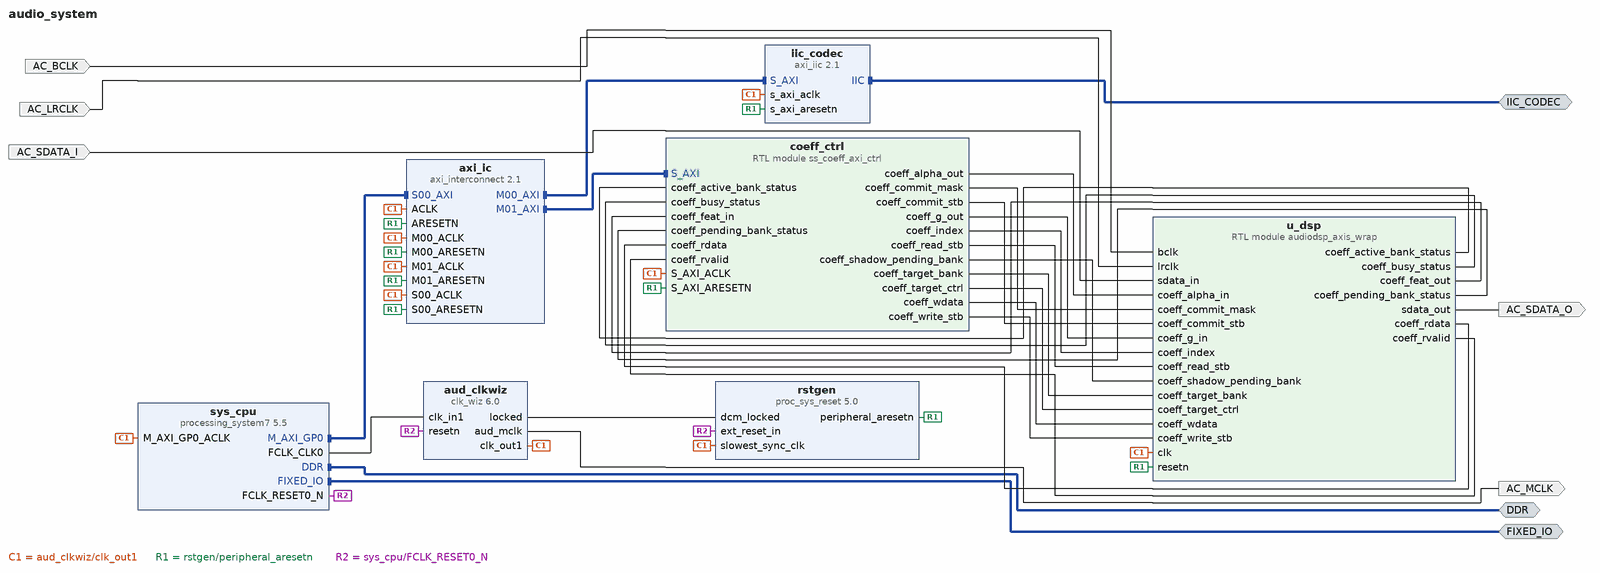
[diagram p0: block diagram of the top level]
# Vivado block design audio_system, xc7z020clg484-1, Vivado 2024.1
create_bd_design audio_system

create_bd_intf_port -mode Master -vlnv xilinx.com:interface:ddrx_rtl:1.0 DDR
create_bd_intf_port -mode Master -vlnv xilinx.com:display_processing_system7:fixedio_rtl:1.0 FIXED_IO
create_bd_intf_port -mode Master -vlnv xilinx.com:interface:iic_rtl:1.0 IIC_CODEC
create_bd_port -dir I AC_BCLK
create_bd_port -dir I AC_LRCLK
create_bd_port -dir I AC_SDATA_I
create_bd_port -dir O AC_SDATA_O
create_bd_port -dir O AC_MCLK

create_bd_cell -type ip -vlnv xilinx.com:ip:processing_system7:5.5 sys_cpu
set_property -dict [list \
  CONFIG.PCW_APU_PERIPHERAL_FREQMHZ 666.666667 \
  CONFIG.PCW_ENET0_ENET0_IO {MIO 16 .. 27} \
  CONFIG.PCW_ENET0_GRP_MDIO_ENABLE 1 \
  CONFIG.PCW_ENET0_GRP_MDIO_IO {MIO 52 .. 53} \
  CONFIG.PCW_ENET0_PERIPHERAL_ENABLE 1 \
  CONFIG.PCW_ENET0_RESET_ENABLE 0 \
  CONFIG.PCW_ENET_RESET_ENABLE 1 \
  CONFIG.PCW_ENET_RESET_SELECT {Share reset pin} \
  CONFIG.PCW_FPGA0_PERIPHERAL_FREQMHZ 100.0 \
  CONFIG.PCW_FPGA1_PERIPHERAL_FREQMHZ 150.000000 \
  CONFIG.PCW_GPIO_MIO_GPIO_ENABLE 1 \
  CONFIG.PCW_GPIO_MIO_GPIO_IO MIO \
  CONFIG.PCW_I2C_RESET_ENABLE 1 \
  CONFIG.PCW_PRESET_BANK1_VOLTAGE {LVCMOS 1.8V} \
  CONFIG.PCW_QSPI_GRP_SINGLE_SS_ENABLE 1 \
  CONFIG.PCW_QSPI_GRP_SINGLE_SS_IO {MIO 1 .. 6} \
  CONFIG.PCW_QSPI_PERIPHERAL_ENABLE 1 \
  CONFIG.PCW_QSPI_QSPI_IO {MIO 1 .. 6} \
  CONFIG.PCW_SD0_GRP_CD_ENABLE 1 \
  CONFIG.PCW_SD0_GRP_CD_IO {MIO 47} \
  CONFIG.PCW_SD0_GRP_WP_ENABLE 1 \
  CONFIG.PCW_SD0_GRP_WP_IO {MIO 46} \
  CONFIG.PCW_SD0_PERIPHERAL_ENABLE 1 \
  CONFIG.PCW_SD0_SD0_IO {MIO 40 .. 45} \
  CONFIG.PCW_SDIO_PERIPHERAL_FREQMHZ 50 \
  CONFIG.PCW_SINGLE_QSPI_DATA_MODE x4 \
  CONFIG.PCW_TTC0_PERIPHERAL_ENABLE 1 \
  CONFIG.PCW_TTC0_TTC0_IO EMIO \
  CONFIG.PCW_UART1_PERIPHERAL_ENABLE 1 \
  CONFIG.PCW_UART1_UART1_IO {MIO 48 .. 49} \
  CONFIG.PCW_UART_PERIPHERAL_FREQMHZ 50 \
  CONFIG.PCW_UIPARAM_DDR_FREQ_MHZ 533.333313 \
  CONFIG.PCW_UIPARAM_DDR_PARTNO {MT41J128M16 HA-15E} \
  CONFIG.PCW_USB0_PERIPHERAL_ENABLE 1 \
  CONFIG.PCW_USB0_RESET_ENABLE 0 \
  CONFIG.PCW_USB0_USB0_IO {MIO 28 .. 39} \
  CONFIG.PCW_USB_RESET_ENABLE 1 \
  CONFIG.PCW_USB_RESET_SELECT {Share reset pin} \
  CONFIG.preset ZedBoard \
] [get_bd_cells sys_cpu]
# 227 more settings of sys_cpu are not shown: defaults, MIO pin electricals, DDR timing, and values the tool derives
create_bd_cell -type ip -vlnv xilinx.com:ip:clk_wiz:6.0 aud_clkwiz
set_property -dict [list \
  CONFIG.CLKOUT1_JITTER 146.380 \
  CONFIG.CLKOUT1_REQUESTED_OUT_FREQ 100 \
  CONFIG.CLKOUT2_REQUESTED_OUT_FREQ 12.288 \
  CONFIG.CLKOUT2_USED true \
  CONFIG.CLK_OUT2_PORT aud_mclk \
  CONFIG.MMCM_CLKOUT0_DIVIDE_F 7.250 \
  CONFIG.PRIM_SOURCE Global_buffer \
  CONFIG.RESET_TYPE ACTIVE_LOW \
] [get_bd_cells aud_clkwiz]
create_bd_cell -type ip -vlnv xilinx.com:ip:proc_sys_reset:5.0 rstgen
create_bd_cell -type ip -vlnv xilinx.com:ip:axi_interconnect:2.1 axi_ic
set_property -dict {CONFIG.NUM_MI 2 CONFIG.NUM_SI 1} [get_bd_cells axi_ic]
create_bd_cell -type ip -vlnv xilinx.com:ip:axi_iic:2.1 iic_codec
create_bd_cell -type module -reference audiodsp_axis_wrap u_dsp
create_bd_cell -type module -reference ss_coeff_axi_ctrl coeff_ctrl

# ---- connections ----

connect_bd_intf_net [get_bd_intf_pins axi_ic/M00_AXI] [get_bd_intf_pins iic_codec/S_AXI]
connect_bd_intf_net [get_bd_intf_pins axi_ic/M01_AXI] [get_bd_intf_pins coeff_ctrl/S_AXI]
connect_bd_intf_net [get_bd_intf_pins iic_codec/IIC] [get_bd_intf_ports IIC_CODEC]
connect_bd_intf_net [get_bd_intf_ports DDR] [get_bd_intf_pins sys_cpu/DDR]
connect_bd_intf_net [get_bd_intf_ports FIXED_IO] [get_bd_intf_pins sys_cpu/FIXED_IO]
connect_bd_intf_net [get_bd_intf_pins sys_cpu/M_AXI_GP0] [get_bd_intf_pins axi_ic/S00_AXI]
connect_bd_net [get_bd_ports AC_BCLK] [get_bd_pins u_dsp/bclk]
connect_bd_net [get_bd_ports AC_LRCLK] [get_bd_pins u_dsp/lrclk]
connect_bd_net [get_bd_ports AC_SDATA_I] [get_bd_pins u_dsp/sdata_in]
connect_bd_net [get_bd_pins aud_clkwiz/aud_mclk] [get_bd_ports AC_MCLK]
connect_bd_net [get_bd_pins aud_clkwiz/clk_out1] \
  [get_bd_pins rstgen/slowest_sync_clk] [get_bd_pins axi_ic/ACLK] [get_bd_pins axi_ic/S00_ACLK] [get_bd_pins axi_ic/M00_ACLK] \
  [get_bd_pins axi_ic/M01_ACLK] [get_bd_pins sys_cpu/M_AXI_GP0_ACLK] [get_bd_pins iic_codec/s_axi_aclk] \
  [get_bd_pins u_dsp/clk] [get_bd_pins coeff_ctrl/S_AXI_ACLK]
connect_bd_net [get_bd_pins aud_clkwiz/locked] [get_bd_pins rstgen/dcm_locked]
connect_bd_net [get_bd_pins coeff_ctrl/coeff_alpha_out] [get_bd_pins u_dsp/coeff_alpha_in]
connect_bd_net [get_bd_pins coeff_ctrl/coeff_commit_mask] [get_bd_pins u_dsp/coeff_commit_mask]
connect_bd_net [get_bd_pins coeff_ctrl/coeff_commit_stb] [get_bd_pins u_dsp/coeff_commit_stb]
connect_bd_net [get_bd_pins coeff_ctrl/coeff_g_out] [get_bd_pins u_dsp/coeff_g_in]
connect_bd_net [get_bd_pins coeff_ctrl/coeff_index] [get_bd_pins u_dsp/coeff_index]
connect_bd_net [get_bd_pins coeff_ctrl/coeff_read_stb] [get_bd_pins u_dsp/coeff_read_stb]
connect_bd_net [get_bd_pins coeff_ctrl/coeff_shadow_pending_bank] [get_bd_pins u_dsp/coeff_shadow_pending_bank]
connect_bd_net [get_bd_pins coeff_ctrl/coeff_target_bank] [get_bd_pins u_dsp/coeff_target_bank]
connect_bd_net [get_bd_pins coeff_ctrl/coeff_target_ctrl] [get_bd_pins u_dsp/coeff_target_ctrl]
connect_bd_net [get_bd_pins coeff_ctrl/coeff_wdata] [get_bd_pins u_dsp/coeff_wdata]
connect_bd_net [get_bd_pins coeff_ctrl/coeff_write_stb] [get_bd_pins u_dsp/coeff_write_stb]
connect_bd_net [get_bd_pins rstgen/peripheral_aresetn] \
  [get_bd_pins axi_ic/ARESETN] [get_bd_pins axi_ic/S00_ARESETN] [get_bd_pins axi_ic/M00_ARESETN] \
  [get_bd_pins axi_ic/M01_ARESETN] [get_bd_pins iic_codec/s_axi_aresetn] [get_bd_pins u_dsp/resetn] \
  [get_bd_pins coeff_ctrl/S_AXI_ARESETN]
connect_bd_net [get_bd_pins sys_cpu/FCLK_CLK0] [get_bd_pins aud_clkwiz/clk_in1]
connect_bd_net [get_bd_pins sys_cpu/FCLK_RESET0_N] [get_bd_pins aud_clkwiz/resetn] [get_bd_pins rstgen/ext_reset_in]
connect_bd_net [get_bd_pins u_dsp/coeff_active_bank_status] [get_bd_pins coeff_ctrl/coeff_active_bank_status]
connect_bd_net [get_bd_pins u_dsp/coeff_busy_status] [get_bd_pins coeff_ctrl/coeff_busy_status]
connect_bd_net [get_bd_pins u_dsp/coeff_feat_out] [get_bd_pins coeff_ctrl/coeff_feat_in]
connect_bd_net [get_bd_pins u_dsp/coeff_pending_bank_status] [get_bd_pins coeff_ctrl/coeff_pending_bank_status]
connect_bd_net [get_bd_pins u_dsp/coeff_rdata] [get_bd_pins coeff_ctrl/coeff_rdata]
connect_bd_net [get_bd_pins u_dsp/coeff_rvalid] [get_bd_pins coeff_ctrl/coeff_rvalid]
connect_bd_net [get_bd_pins u_dsp/sdata_out] [get_bd_ports AC_SDATA_O]

# ---- address map ----
assign_bd_address -offset 0x41600000 -range 64K -target_address_space [get_bd_addr_spaces sys_cpu/Data] [get_bd_addr_segs iic_codec/S_AXI/Reg]
assign_bd_address -offset 0x43C00000 -range 4K -target_address_space [get_bd_addr_spaces sys_cpu/Data] [get_bd_addr_segs coeff_ctrl/S_AXI/reg0]

validate_bd_design
save_bd_design
